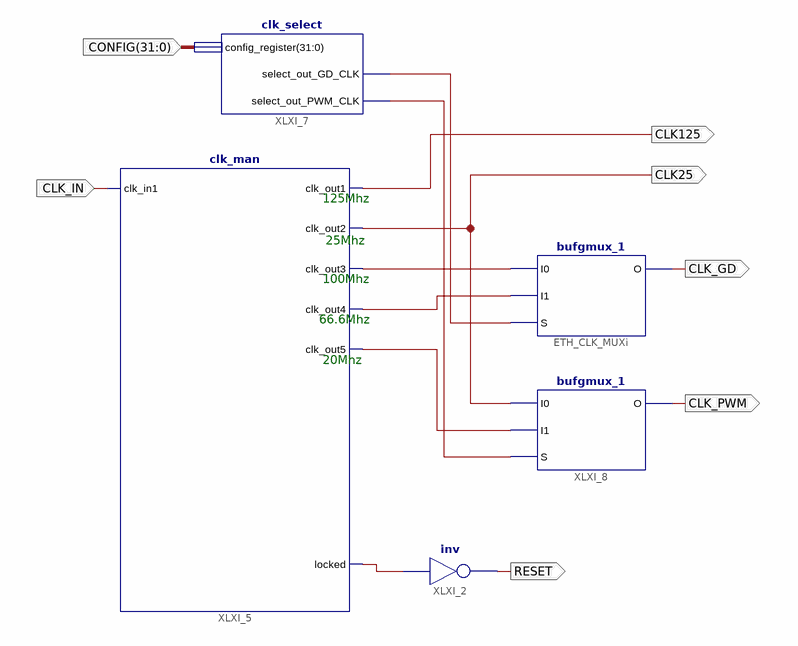
[diagram p0: schematic sheet 1]
// Xilinx ISE schematic CLKMAIN125.sch (spartan6) as structural Verilog: 5 symbols, 7 ports
module CLKMAIN125 (
  input  CLK_IN,
  input  [31:0] CONFIG,
  output RESET,
  output CLK_GD,
  output CLK_PWM,
  output CLK25,
  output CLK125
);

  wire XLXN_1, XLXN_3, XLXN_4, XLXN_5, XLXN_7, XLXN_12;

  not XLXI_2 (RESET, XLXN_1);
  clk_man XLXI_5 (
    .clk_in1(CLK_IN), .clk_out1(CLK125), .clk_out2(CLK25), .clk_out3(XLXN_3), .clk_out4(XLXN_4),
    .clk_out5(XLXN_7), .locked(XLXN_1));
  bufgmux_1 ETH_CLK_MUXi (.I0(XLXN_3), .I1(XLXN_4), .S(XLXN_5), .O(CLK_GD));
  clk_select XLXI_7 (.config_register(CONFIG), .select_out_GD_CLK(XLXN_5), .select_out_PWM_CLK(XLXN_12));
  bufgmux_1 XLXI_8 (.I0(CLK25), .I1(XLXN_7), .S(XLXN_12), .O(CLK_PWM));

  // Notes on the sheet:
  //   125Mhz
  //   25Mhz
  //   100Mhz
  //   66.6Mhz
  //   20Mhz
endmodule
